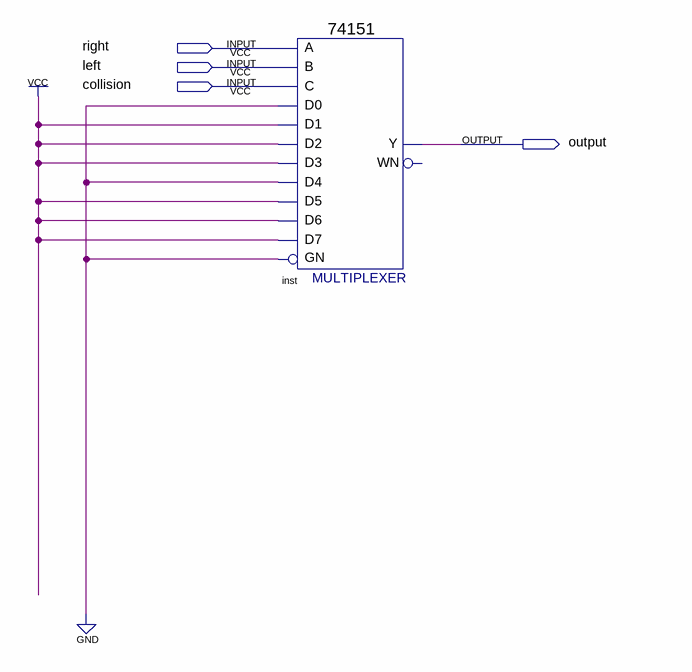
[diagram p0: schematic sheet]
// Quartus schematic multiplexer.bdf as structural Verilog: 1 symbols, 4 pins
module multiplexer (
  input  right,
  input  left,
  input  collision,
  output \output 
);

  \74151  inst (
    .GN(1'b0), .C(collision), .B(left), .A(right), .D5(1'b1), .D0(1'b0), .D1(1'b1), .D4(1'b0), .D3(1'b1),
    .D2(1'b1), .D6(1'b1), .D7(1'b1), .Y(\output ));  // open: WN
endmodule
